# Altium schematic sheet CanTranceiver.SchDoc
size A4
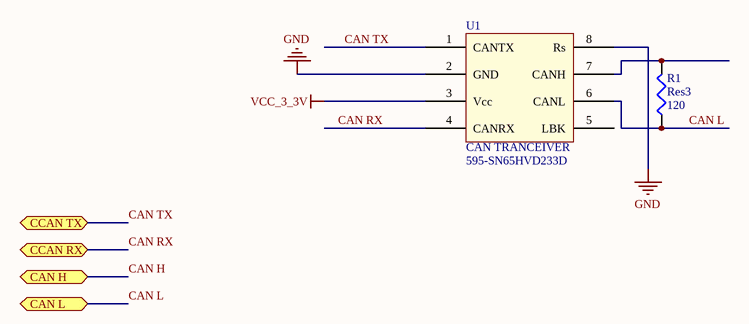
[diagram p0: CanTranceiver.SchDoc]

## Parts
R1  Res3  value 120  [R0805]
U1  CAN TRANCEIVER  Supplier Part Number 1: 595-SN65HVD233D  [SOP8]

## Ports
CAN H (bidir), CAN L (bidir), CCAN RX (bidir), CCAN TX (bidir)

## Nets
GND: U1.2(GND) U1.8(Rs)
VCC_3_3V: U1.3(Vcc)
CAN H: port CAN H
CAN L: R1.1 U1.6(CANL) ; port CAN L
CAN RX: U1.4(CANRX) ; port CCAN RX
CAN TX: U1.1(CANTX) ; port CCAN TX
NetR1_2: R1.2 U1.7(CANH)

Not connected (* = marked no-connect by the designer): U1 5(LBK)

## Library data of the parts
R1 = Res3: Resistor; Published: 8-Jun-2000; LatestRevisionDate: 29-May-2009; LatestRevisionNote: IPC-7351 Footprint Added.; PackageReference: J1-0603; Publisher: Altium Limited; PackageDescription: Chip Resistor
U1 = 595-SN65HVD233: Supplier 1: Mouser